# Altium schematic sheet 2_MPC555.SchDoc: Schema MPC 555
size A4; Organization1: Sciences of Technology Buchs; Size: A4
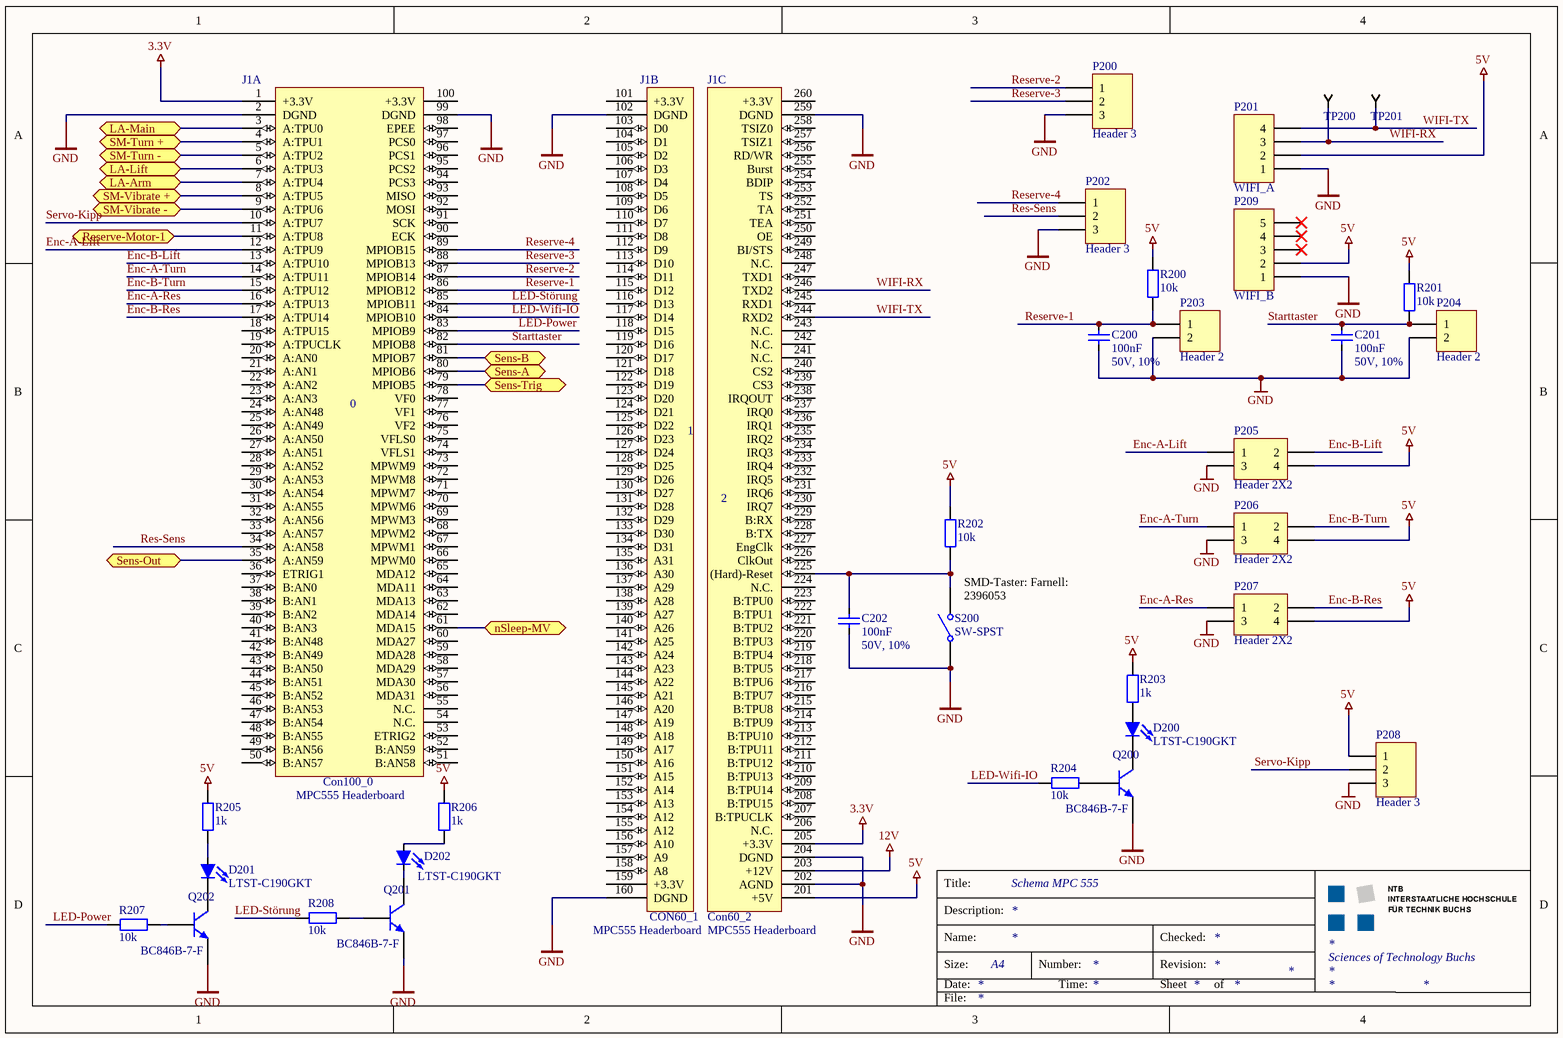
[diagram p0: 2_MPC555.SchDoc]

## Parts
C200  100nF  ValAddon: 50V, 10%  [CAP-0805[2012]]
C201  100nF  ValAddon: 50V, 10%  [CAP-0805[2012]]
C202  100nF  ValAddon: 50V, 10%  [CAP-0805[2012]]
D200  LTST-C190GKT  [LED 0603 green]
D201  LTST-C190GKT  [LED 0603 green]
D202  LTST-C190GKT  [LED 0603 green]
J1  MPC555 Headerboard  [MPC555 Headerboard THT]  (parts A,B,C of 3)
P200  Header 3  [HDR1X3]
P201  WIFI_A  [HDR1X4]
P202  Header 3  [HDR1X3]
P203  Header 2  [HDR1X2]
P204  Header 2  [HDR1X2]
P205  Header 2X2  [HDR2X2]
P206  Header 2X2  [HDR2X2]
P207  Header 2X2  [HDR2X2]
P208  Header 3  [HDR1X3]
P209  WIFI_B  [HDR1X5]
Q200  BC846B-7-F  [SOT-23]
Q201  BC846B-7-F  [SOT-23]
Q202  BC846B-7-F  [SOT-23]
R200  10k  [RES-0805[2012]]
R201  10k  [RES-0805[2012]]
R202  10k  [RES-0805[2012]]
R203  1k  [RES-0805[2012]]
R204  10k  [RES-0805[2012]]
R205  1k  [RES-0805[2012]]
R206  1k  [RES-0805[2012]]
R207  10k  [RES-0805[2012]]
R208  10k  [RES-0805[2012]]
S200  SW-SPST  [B3SE-1002P]
TP200  Testpoint SMD 1206  [TP-SMD-1206]  (value not drawn)  (no BOM)
TP201  Testpoint SMD 1206  [TP-SMD-1206]  (value not drawn)  (no BOM)

## Ports
LA-Arm, LA-Lift, LA-Main, nSleep-MV, Reserve-Motor-1, Sens-A, Sens-B, Sens-Out, Sens-Trig, SM-Turn +, SM-Turn -, SM-Vibrate +, SM-Vibrate -

## Nets
3.3V: J1.1(+3.3V) J1.205(+3.3V)
5V: J1.201(+5V) P201.2 P205.4 P206.4 P207.4 P208.1 P209.2 R200.2 R201.2 R202.2 R203.2 R205.2 R206.2
12V: J1.203(+12V)
GND: C200.1(Pos) C201.1(Pos) C202.1(Pos) J1.2(DGND) J1.99(DGND) J1.102(DGND) J1.160(DGND) J1.202(AGND) J1.204(DGND) J1.259(DGND) P200.3 P201.1 P202.3 P203.2 P204.2 P205.3 P206.3 P207.3 P208.3 P209.1 Q200.2(E) Q201.2(E) Q202.2(E) S200.1(COMMON)
Enc-A-Lift: J1.12(A:TPU9) P205.1
Enc-A-Res: J1.16(A:TPU13) P207.1
Enc-A-Turn: J1.14(A:TPU11) P206.1
Enc-B-Lift: J1.13(A:TPU10) P205.2
Enc-B-Res: J1.17(A:TPU14) P207.2
Enc-B-Turn: J1.15(A:TPU12) P206.2
LA-Arm: J1.7(A:TPU4) ; port LA-Arm
LA-Lift: J1.6(A:TPU3) ; port LA-Lift
LA-Main: J1.3(A:TPU0) ; port LA-Main
LED-Power: J1.83(MPIOB9) R207.1
LED-Störung: J1.85(MPIOB11) R208.1
LED-Wifi-IO: J1.84(MPIOB10) R204.1
nSleep-MV: J1.61(MDA15) ; port nSleep-MV
Res-Sens: J1.34(A:AN58) P202.2
Reserve-1: C200.2(Neg) J1.86(MPIOB12) P203.1 R200.1
Reserve-2: J1.87(MPIOB14) P200.1
Reserve-3: J1.88(MPIOB13) P200.2
Reserve-4: J1.89(MPIOB15) P202.1
Reserve-Motor-1: J1.11(A:TPU8) ; port Reserve-Motor-1
Sens-A: J1.80(MPIOB6) ; port Sens-A
Sens-B: J1.81(MPIOB7) ; port Sens-B
Sens-Out: J1.35(A:AN59) ; port Sens-Out
Sens-Trig: J1.79(MPIOB5) ; port Sens-Trig
Servo-Kipp: J1.10(A:TPU7) P208.2
SM-Turn +: J1.4(A:TPU1) ; port SM-Turn +
SM-Turn -: J1.5(A:TPU2) ; port SM-Turn -
SM-Vibrate +: J1.8(A:TPU5) ; port SM-Vibrate +
SM-Vibrate -: J1.9(A:TPU6) ; port SM-Vibrate -
Starttaster: C201.2(Neg) J1.82(MPIOB8) P204.1 R201.1
WIFI-RX: J1.246(TXD2) P201.3 TP200.1
WIFI-TX: J1.244(RXD2) P201.4 TP201.1
NetC202_2: C202.2(Neg) J1.225((Hard)-Reset) R202.1 S200.2(NO)
NetD200_1: D200.1(K) Q200.3(C)
NetD200_2: D200.2(A) R203.1
NetD201_1: D201.1(K) Q202.3(C)
NetD201_2: D201.2(A) R205.1
NetD202_1: D202.1(K) Q201.3(C)
NetD202_2: D202.2(A) R206.1
NetQ200_1: Q200.1(B) R204.2
NetQ201_1: Q201.1(B) R208.2
NetQ202_1: Q202.1(B) R207.2

Not connected (* = marked no-connect by the designer): J1 18(A:TPU15) 19(A:TPUCLK) 20(A:AN0) 21(A:AN1) 22(A:AN2) 23(A:AN3) 24(A:AN48) 25(A:AN49) 26(A:AN50) 27(A:AN51) 28(A:AN52) 29(A:AN53) 30(A:AN54) 31(A:AN55) 32(A:AN56) 33(A:AN57) 36(ETRIG1) 37(B:AN0) 38(B:AN1) 39(B:AN2) 40(B:AN3) 41(B:AN48) 42(B:AN49) 43(B:AN50) 44(B:AN51) 45(B:AN52) 46(B:AN53) 47(B:AN54) 48(B:AN55) 49(B:AN56) 50(B:AN57) 51(B:AN58) 52(B:AN59) 53(ETRIG2) 54(N.C.) 55(N.C.) 56(MDA31) 57(MDA30) 58(MDA29) 59(MDA28) 60(MDA27) 62(MDA14) 63(MDA13) 64(MDA11) 65(MDA12) 66(MPWM0) 67(MPWM1) 68(MPWM2) 69(MPWM3) 70(MPWM6) 71(MPWM7) 72(MPWM8) 73(MPWM9) 74(VFLS1) 75(VFLS0) 76(VF2) 77(VF1) 78(VF0) 90(ECK) 91(SCK) 92(MOSI) 93(MISO) 94(PCS3) 95(PCS2) 96(PCS1) 97(PCS0) 98(EPEE) 100(+3.3V) 101(+3.3V) 103(D0) 104(D1) 105(D2) 106(D3) 107(D4) 108(D5) 109(D6) 110(D7) 111(D8) 112(D9) 113(D10) 114(D11) 115(D12) 116(D13) 117(D14) 118(D15) 119(D16) 120(D17) 121(D18) 122(D19) 123(D20) 124(D21) 125(D22) 126(D23) 127(D24) 128(D25) 129(D26) 130(D27) 131(D28) 132(D29) 133(D30) 134(D31) 135(A31) 136(A30) 137(A29) 138(A28) 139(A27) 140(A26) 141(A25) 142(A24) 143(A23) 144(A22) 145(A21) 146(A20) 147(A19) 148(A18) 149(A17) 150(A16) 151(A15) 152(A14) 153(A13) 154(A12) 155(A12) 156(A10) 157(A9) 158(A8) 159(+3.3V) 206(N.C.) 207(B:TPUCLK) 208(B:TPU15) 209(B:TPU14) 210(B:TPU13) 211(B:TPU12) 212(B:TPU11) 213(B:TPU10) 214(B:TPU9) 215(B:TPU8) 216(B:TPU7) 217(B:TPU6) 218(B:TPU5) 219(B:TPU4) 220(B:TPU3) 221(B:TPU2) 222(B:TPU1) 223(B:TPU0) 224(N.C.) 226(ClkOut) 227(EngClk) 228(B:TX) 229(B:RX) 230(IRQ7) 231(IRQ6) 232(IRQ5) 233(IRQ4) 234(IRQ3) 235(IRQ2) 236(IRQ1) 237(IRQ0) 238(IRQOUT) 239(CS3) 240(CS2) 241(N.C.) 242(N.C.) 243(N.C.) 245(RXD1) 247(TXD1) 248(N.C.) 249(BI/STS) 250(OE) 251(TEA) 252(TA) 253(TS) 254(BDIP) 255(Burst) 256(RD/WR) 257(TSIZ1) 258(TSIZ0) 260(+3.3V); P209 3* 4* 5*

## Notes on the sheet
- (near S200) SMD-Taster: Farnell: 2396053
- Title:
- Description:
- Size:
- Date:
- Name:
- Number:
- Time:
- Revision:
- Sheet
- Checked:
- of
- File:
- (in symbol MPC555 Headerboard, part A) 0; Con100_0
- (in symbol MPC555 Headerboard, part B) CON60_1
- (in symbol MPC555 Headerboard, part C) Con60_2

## Library data of the parts
C200-C202 = MLCC 0805 100n 50V: 100n 50V X7R MLCC 0805 (1608 Metric); Tolerance: 10%; Case-EIA: 0803; Case-Metric: 2013; Rated Voltage: 50V; Temperature Characteristics EIA: X7R; Temperature Range EIA: -55C/+125C; Value: 100nF
D200-D202 = LED Green: LED SMD 0603 green 6mcd; Forward Current: 30mA; Forward Voltage: 2.1V; Spectrum: 565nm; Color: green; ComponentLink1Description: Datasheet LTST-C190GKT; ComponentLink1URL: V:\Diodes\Lite-On-LTST-C190GKT.pdf
J1 = MPC555 Headerboard: NTB MPC555 Headerboard
P200 P202 P208 = Header 3: Header, 3-Pin; LatestRevisionDate: 17-Jul-2002; LatestRevisionNote: Re-released for DXP Platform.; Publisher: Altium Limited
P201 = Header 4: Header, 4-Pin; LatestRevisionDate: 17-Jul-2002; LatestRevisionNote: Re-released for DXP Platform.; Publisher: Altium Limited
P203 P204 = Header 2: Header, 2-Pin; LatestRevisionDate: 17-Jul-2002; LatestRevisionNote: Re-released for DXP Platform.; Publisher: Altium Limited
P205-P207 = Header 2X2: Header, 2-Pin, Dual row; LatestRevisionDate: 17-Jul-2002; LatestRevisionNote: Re-released for DXP Platform.; Publisher: Altium Limited
P209 = Header 5: Header, 5-Pin; LatestRevisionDate: 17-Jul-2002; LatestRevisionNote: Re-released for DXP Platform.; Publisher: Altium Limited
Q200-Q202 = BC846B-SOT23: NPN General-purpose Transistor; Manufacturer: DIODES INC; #Class: SEMICONDUCTOR-TRANSISTOR; #ClassSub: BJT-NPN; RefFootprint: DIODS_SOT23_1B2E3C_3_H; RefSchema: DIODS_BC846B-7-F_SOT23; Published: 17-Sep-2003; Publisher: Altium Limited; ComponentLink1Description: Manufacturer Link; ComponentLink1URL: http://www.diodes.com/products/catalog/detail.php?item-id=6689&popup=datasheet; ComponentLink2Description: Datasheet; ComponentLink2URL: http://www.diodes.com/datasheets/ds11108.pdf; ComponentLink3Description: Packaging Specification; ComponentLink3URL: http://www.diodes.com/datasheets/ap02001.pdf; Distributor: Farnell; Manufacturer PartNr: BC846B-7-F; Distributor PartNr: 1773617; Status: nLager; RefFileFOO: *; RefFileSCH: *
R200-R208 = RES 0805: 0805 (2013 Metric) 1/10 W 10K 1 Thick Film Chip Resistor; Power: 1/10 W; Case-EIA: 0805; Case-Metric: 2013; Tolerance: 1%; Temp. Coefficent: ±100ppm; Technology: SMT; Value: 10k
S200 = SW-SPST: Single-Pole, Single-Throw Switch; Published: 24-Mar-1999; LatestRevisionDate: 17-Jul-2002; LatestRevisionNote: Re-released for DXP Platform.; PackageReference: SPST-2; Publisher: Altium Limited; PackageDescription: Switch; 2 Leads
TP200 TP201 = Testpoint SMD 1206: Testpoint xSmall; Type: Standard (No BOM)